# EAGLE design Temperature and Humidity tester (EAGLE 9.3.2)
Assembly variants: <unnamed>
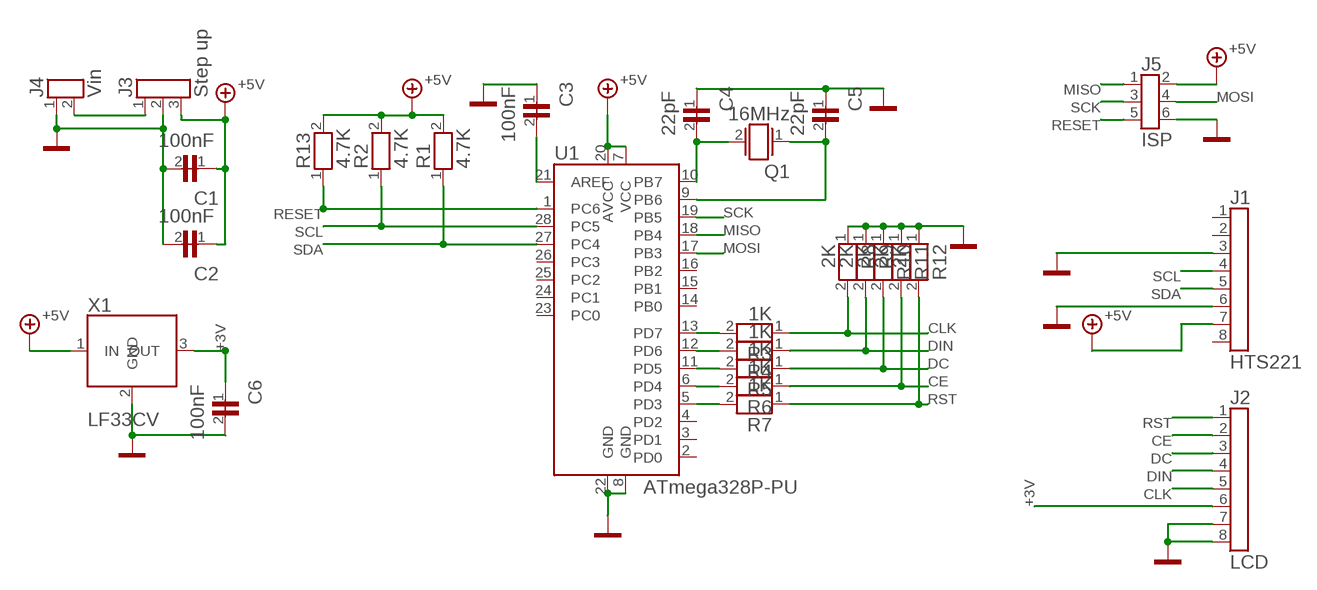
[diagram p0: schematic, sheet 1]

## Parts
C1  100nF  B37982-N5104-M_42  [3X5R2,54_42]
C2  100nF  B37982-N5104-M_43  [3X5R2,54_43]
C3  100nF  B37982-N5104-M_44  [3X5R2,54_44]
C4  22pF  C-CERAMIC-2,54_100V_2%_22PF_47  [6X6R2,54_DISC_47]
C5  22pF  C-CERAMIC-2,54_100V_2%_22PF_48  [6X6R2,54_DISC_48]
C6  100nF  B37982-N5104-M_66  [3X5R2,54_66]
J1  HTS221  PINHEADER_1X08_G_2,54_1  [STIFTLEISTE_1X08_G_2,54_1]
J2  LCD  PINHEADER_1X08_G_2,54_2  [STIFTLEISTE_1X08_G_2,54_2]
J3  Step up  PINHEADER_1X03_G_2,54_3  [STIFTLEISTE_1X03_G_2,54_3]
J4  Vin  PINHEADER_1X02_G_2,54_4  [STIFTLEISTE_1X02_G_2,54_4]
J5  ISP  PINHEADER_2X03_G_2,54_59  [STIFTLEISTE_2X03_G_2,54_59]
Q1  16MHz  LFXTAL003231_46  [HC49/U_46]
R1  4.7K  R_MET_10K_0204_27  [0204_MET_27]
R2  4.7K  R_MET_10K_0204_28  [0204_MET_28]
R3  1K  R_MET_10K_0204_31  [0204_MET_31]
R4  1K  R_MET_10K_0204_32  [0204_MET_32]
R5  1K  R_MET_10K_0204_33  [0204_MET_33]
R6  1K  R_MET_10K_0204_34  [0204_MET_34]
R7  1K  R_MET_10K_0204_35  [0204_MET_35]
R8  2K  R_MET_10K_0204_36  [0204_MET_36]
R9  2K  R_MET_10K_0204_37  [0204_MET_37]
R10  2K  R_MET_10K_0204_38  [0204_MET_38]
R11  2K  R_MET_10K_0204_39  [0204_MET_39]
R12  2K  R_MET_10K_0204_40  [0204_MET_40]
R13  4.7K  R_MET_10K_0204_57  [0204_MET_57]
U1  ATmega328P-PU  ATMEGA328P-PU_0  [DIL28_WB7,62_P2,54_0]
X1  LF33CV  LF33CV_62  [TO220_62]

## Nets
2: J3.1 J4.2
+3V: C6.1 J2.6 X1.3(OUT)
+5V: C1.1 C2.1 J1.7 J3.3 J5.2 R1.2 R2.2 R13.2 U1.7(VCC) U1.20(AVCC) X1.1(IN)
AREF: C3.2 U1.21(AREF)
CE: J2.2 R6.1 R11.2
CLK: J2.5 R3.1 R8.2
DC: J2.3 R5.1 R10.2
DIN: J2.4 R4.1 R9.2
GND: C1.2 C2.2 C3.1 C4.1 C5.1 C6.2 J1.3 J1.6 J2.7 J2.8 J3.2 J4.1 J5.6 R8.1 R9.1 R10.1 R11.1 R12.1 U1.8(GND) U1.22(GND) X1.2(GND)
MISO: J5.1 U1.18(PB4)
MOSI: J5.4 U1.17(PB3)
PB6: C5.2 Q1.1 U1.9(PB6)
PB7: C4.2 Q1.2 U1.10(PB7)
PD4: R6.2 U1.6(PD4)
PD6: R4.2 U1.12(PD6)
RESET: J5.5 R13.1 U1.1(PC6)
RST: J2.1 R7.1 R12.2
SCK: J5.3 U1.19(PB5)
SCL: J1.4 R2.1 U1.28(PC5)
SDA: J1.5 R1.1 U1.27(PC4)
SIG$33: R3.2 U1.13(PD7)
SIG$35: R5.2 U1.11(PD5)
SIG$37: R7.2 U1.5(PD3)
Unconnected: J1.1 J1.2 J1.8 U1.2(PD0) U1.3(PD1) U1.4(PD2) U1.14(PB0) U1.15(PB1) U1.16(PB2) U1.23(PC0) U1.24(PC1) U1.25(PC2) U1.26(PC3)

## Library data of the parts
C1 = TARGET3001!_V20.2.0.74:B37982-N5104-M_42
C2 = TARGET3001!_V20.2.0.74:B37982-N5104-M_43
C3 = TARGET3001!_V20.2.0.74:B37982-N5104-M_44
C4 = TARGET3001!_V20.2.0.74:C-CERAMIC-2,54_100V_2%_22PF_47: Typ EGPU ceramic generators for rectangles, 100 volt capacity. pF 22 ; material NPO ; tolerance ±2% ; dimension. mm 3,5 x
C5 = TARGET3001!_V20.2.0.74:C-CERAMIC-2,54_100V_2%_22PF_48: Typ EGPU ceramic generators for rectangles, 100 volt capacity. pF 22 ; material NPO ; tolerance ±2% ; dimension. mm 3,5 x
C6 = TARGET3001!_V20.2.0.74:B37982-N5104-M_66
J1 = TARGET3001!_V20.2.0.74:PINHEADER_1X08_G_2,54_1: Pin Header
J2 = TARGET3001!_V20.2.0.74:PINHEADER_1X08_G_2,54_2: Pin Header
J3 = TARGET3001!_V20.2.0.74:PINHEADER_1X03_G_2,54_3: Pin Header
J4 = TARGET3001!_V20.2.0.74:PINHEADER_1X02_G_2,54_4: Pin Header
J5 = TARGET3001!_V20.2.0.74:PINHEADER_2X03_G_2,54_59: Pin Header
Q1 = TARGET3001!_V20.2.0.74:LFXTAL003231_46: Quartz 16 MHz, LF XTAL003231, IQD, Series HC49, Frequency 16MHz,
R1 = TARGET3001!_V20.2.0.74:R_MET_10K_0204_27: Metal film resistor 10K-Ohm, 0,4W, 1%
R2 = TARGET3001!_V20.2.0.74:R_MET_10K_0204_28: Metal film resistor 10K-Ohm, 0,4W, 1%
R3 = TARGET3001!_V20.2.0.74:R_MET_10K_0204_31: Metal film resistor 10K-Ohm, 0,4W, 1%
R4 = TARGET3001!_V20.2.0.74:R_MET_10K_0204_32: Metal film resistor 10K-Ohm, 0,4W, 1%
R5 = TARGET3001!_V20.2.0.74:R_MET_10K_0204_33: Metal film resistor 10K-Ohm, 0,4W, 1%
R6 = TARGET3001!_V20.2.0.74:R_MET_10K_0204_34: Metal film resistor 10K-Ohm, 0,4W, 1%
R7 = TARGET3001!_V20.2.0.74:R_MET_10K_0204_35: Metal film resistor 10K-Ohm, 0,4W, 1%
R8 = TARGET3001!_V20.2.0.74:R_MET_10K_0204_36: Metal film resistor 10K-Ohm, 0,4W, 1%
R9 = TARGET3001!_V20.2.0.74:R_MET_10K_0204_37: Metal film resistor 10K-Ohm, 0,4W, 1%
R10 = TARGET3001!_V20.2.0.74:R_MET_10K_0204_38: Metal film resistor 10K-Ohm, 0,4W, 1%
R11 = TARGET3001!_V20.2.0.74:R_MET_10K_0204_39: Metal film resistor 10K-Ohm, 0,4W, 1%
R12 = TARGET3001!_V20.2.0.74:R_MET_10K_0204_40: Metal film resistor 10K-Ohm, 0,4W, 1%
R13 = TARGET3001!_V20.2.0.74:R_MET_10K_0204_57: Metal film resistor 10K-Ohm, 0,4W, 1%
U1 = TARGET3001!_V20.2.0.74:ATMEGA328P-PU_0: Atmel 8-bit Microcontroller with 32KBytes In-System Programmable Flash
X1 = TARGET3001!_V20.2.0.74:LF33CV_62: 3,3V Very Low Drop Voltage Regulators with Inhibit. 3-Lead TO220 Package.

## Board
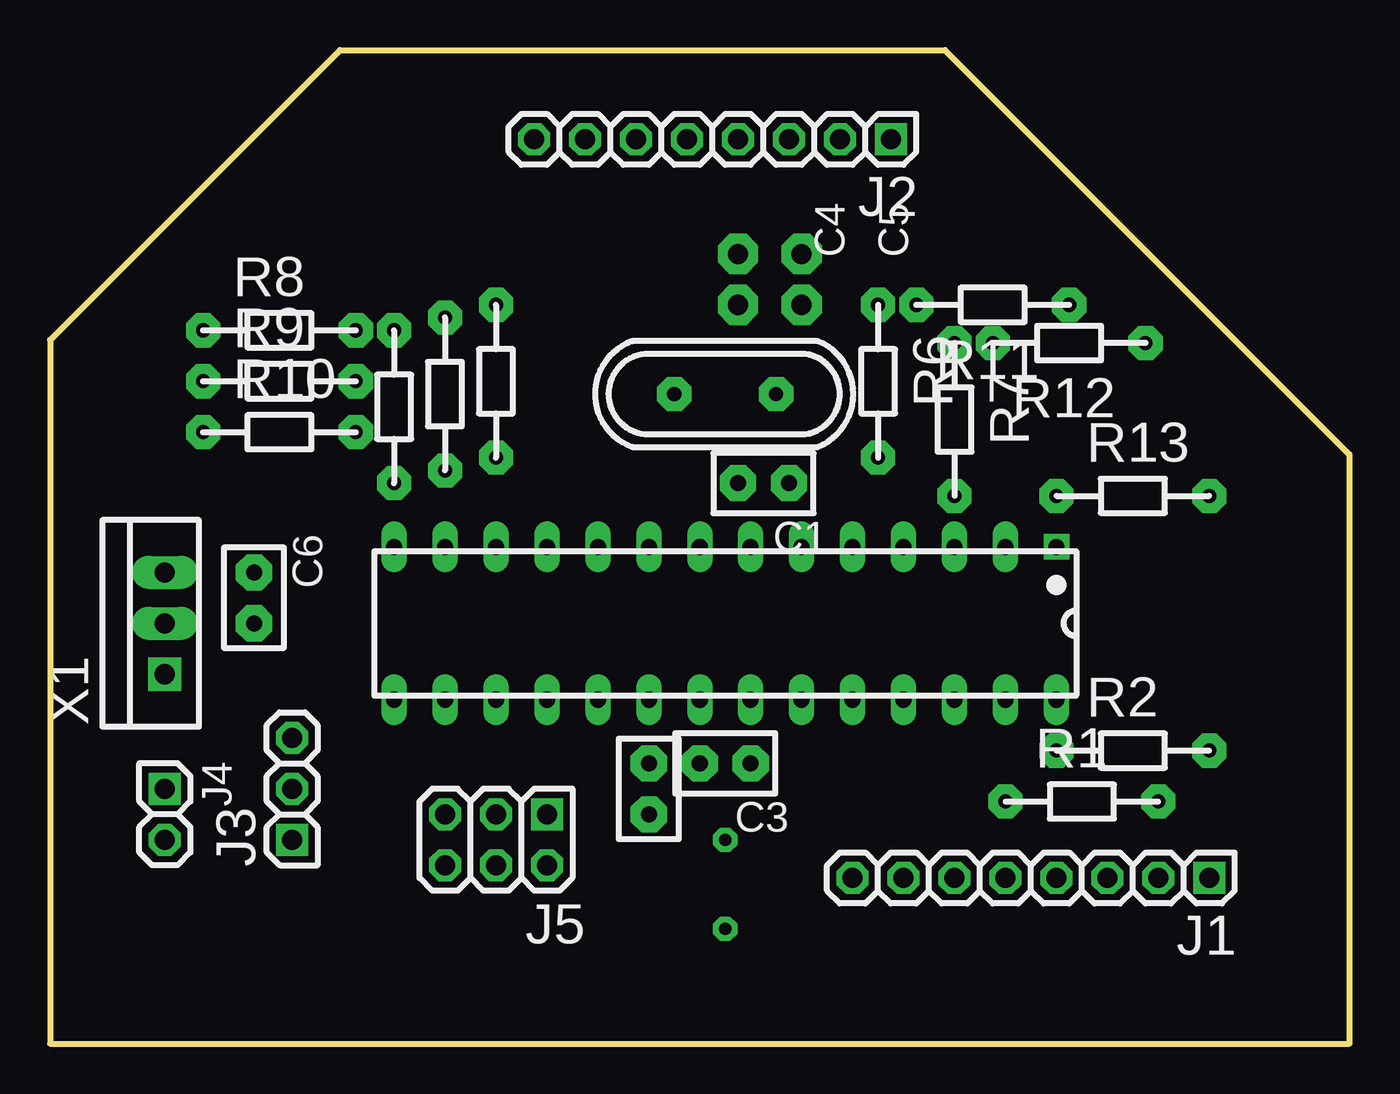
[diagram p1: board, top side]
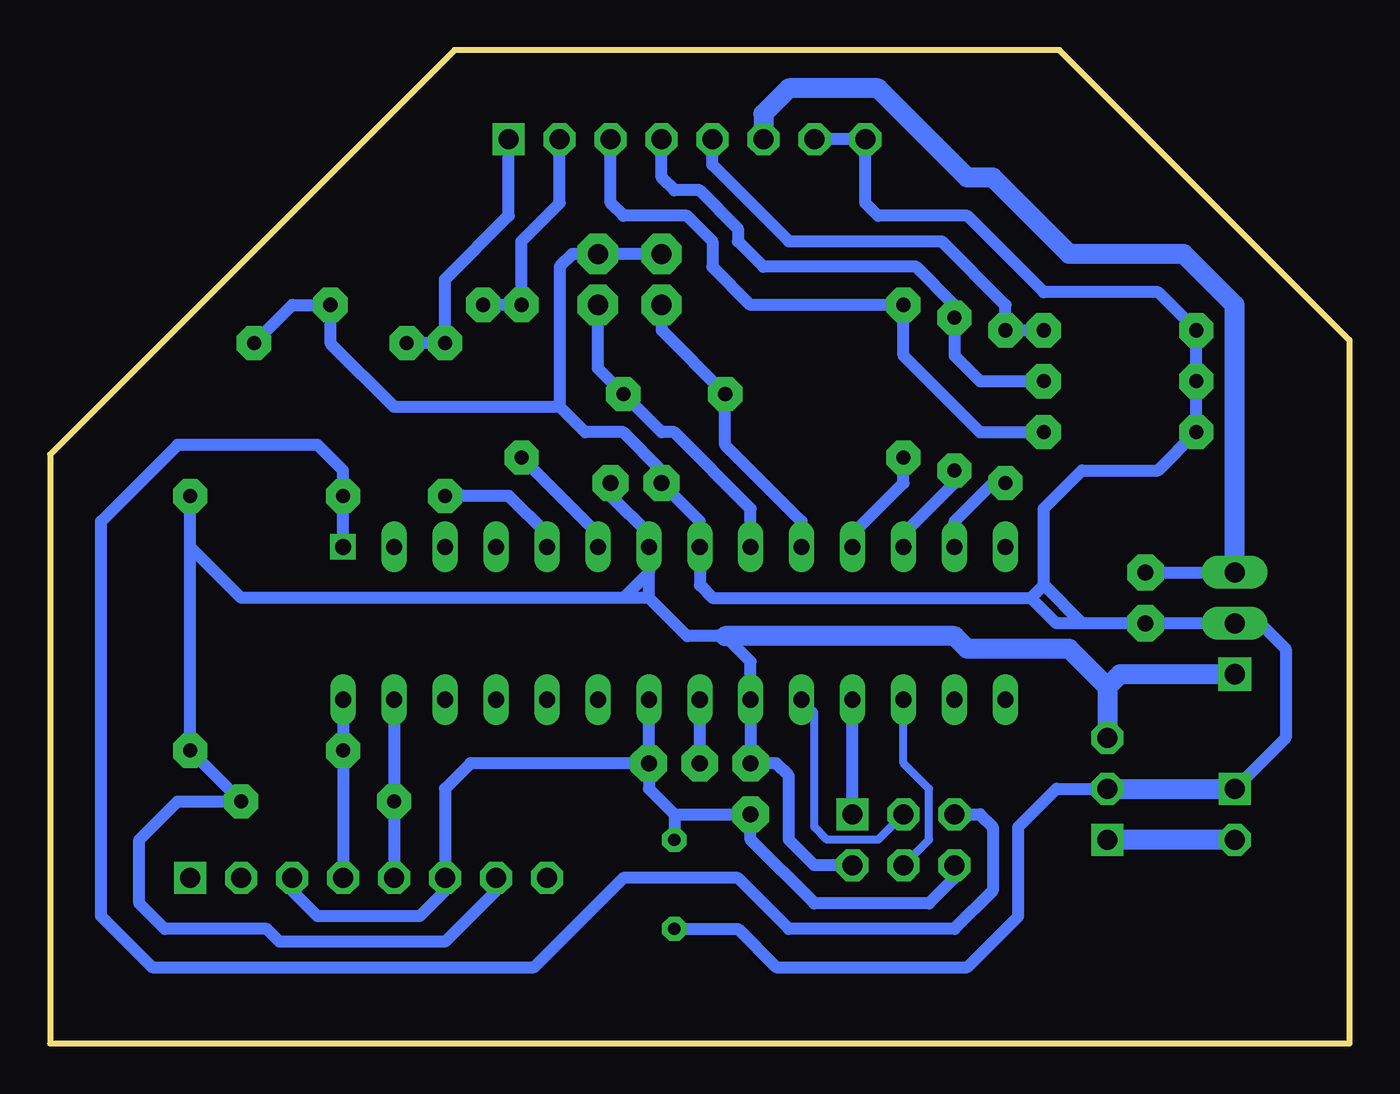
[diagram p2: board, bottom side, seen from below]

Size 64.77 x 49.53 mm. Coordinates in mm from the lower left corner, seen from the top.
Outline: 64.77,29.37 64.77,0 0,0 0,35.09 14.45,49.53 44.61,49.53 64.77,29.37
Copper layers (1*16): Top 0.035mm / dielectric 1.5mm / Bottom 0.035mm
Design rules "TARGET3001!": minimum track width 0.3mm, minimum drill 0.6mm, track to track 0.2mm, track to pad 0.2mm, pad to pad 0.2mm, via to via 0.2mm, smd to smd 0.2mm, copper to edge 1mm, drill to drill 0.3mm, minimum pad ring 0.235mm, minimum via ring 0.3mm, stop-mask expansion 4mil, vias tented up to drill 0mil, thermal gap 10mil

### Footprints (pad centres in the part's own frame; a part is rotated, then mirrored left to right if it is on the bottom)
3X5R2,54_42 = drill 0.8 pad 1.8 octagon: 1 -1.27,0; 2 1.27,0
3X5R2,54_43 = drill 0.8 pad 1.8 octagon: 1 -1.27,0; 2 1.27,0
3X5R2,54_44 = drill 0.8 pad 1.8 octagon: 1 -1.27,0; 2 1.27,0
6X6R2,54_DISC_47 = drill 1 pad 2 octagon: 1 -1.27,0; 2 1.27,0
6X6R2,54_DISC_48 = drill 1 pad 2 octagon: 1 -1.27,0; 2 1.27,0
3X5R2,54_66 = drill 0.8 pad 1.8 octagon: 1 -1.27,0; 2 1.27,0
STIFTLEISTE_1X08_G_2,54_1 = drill 1 pad 1.6 square: 1 0,0 | drill 1 pad 1.6 octagon: 2 2.54,0; 3 5.08,0; 4 7.62,0; 5 10.16,0; 6 12.7,0; 7 15.24,0; 8 17.78,0
STIFTLEISTE_1X08_G_2,54_2 = drill 1 pad 1.6 square: 1 0,0 | drill 1 pad 1.6 octagon: 2 2.54,0; 3 5.08,0; 4 7.62,0; 5 10.16,0; 6 12.7,0; 7 15.24,0; 8 17.78,0
STIFTLEISTE_1X03_G_2,54_3 = drill 1 pad 1.6 square: 1 0,0 | drill 1 pad 1.6 octagon: 2 2.54,0; 3 5.08,0
STIFTLEISTE_1X02_G_2,54_4 = drill 1 pad 1.6 square: 1 0,0 | drill 1 pad 1.6 octagon: 2 2.54,0
STIFTLEISTE_2X03_G_2,54_59 = drill 1 pad 1.6 square: 1 0,0 | drill 1 pad 1.6 octagon: 2 0,2.54; 3 2.54,0; 4 2.54,2.54; 5 5.08,0; 6 5.08,2.54
HC49/U_46 = drill 0.7 pad 1.7 octagon: 1 -2.54,0; 2 2.54,0
0204_MET_27 = drill 0.7 pad 1.7 octagon: 1 -3.81,0; 2 3.81,0
0204_MET_28 = drill 0.7 pad 1.7 octagon: 1 -3.81,0; 2 3.81,0
0204_MET_31 = drill 0.7 pad 1.7 octagon: 1 -3.81,0; 2 3.81,0
0204_MET_32 = drill 0.7 pad 1.7 octagon: 1 -3.81,0; 2 3.81,0
0204_MET_33 = drill 0.7 pad 1.7 octagon: 1 -3.81,0; 2 3.81,0
0204_MET_34 = drill 0.7 pad 1.7 octagon: 1 -3.81,0; 2 3.81,0
0204_MET_35 = drill 0.7 pad 1.7 octagon: 1 -3.81,0; 2 3.81,0
0204_MET_36 = drill 0.7 pad 1.7 octagon: 1 -3.81,0; 2 3.81,0
0204_MET_37 = drill 0.7 pad 1.7 octagon: 1 -3.81,0; 2 3.81,0
0204_MET_38 = drill 0.7 pad 1.7 octagon: 1 -3.81,0; 2 3.81,0
0204_MET_39 = drill 0.7 pad 1.7 octagon: 1 -3.81,0; 2 3.81,0
0204_MET_40 = drill 0.7 pad 1.7 octagon: 1 -3.81,0; 2 3.81,0
0204_MET_57 = drill 0.7 pad 1.7 octagon: 1 -3.81,0; 2 3.81,0
DIL28_WB7,62_P2,54_0 = drill 0.8 pad 1.27 square: 1 -16.51,-3.81 | drill 0.8 pad 1.27 long: 2 -13.97,-3.81; 3 -11.43,-3.81; 4 -8.89,-3.81; 5 -6.35,-3.81; 6 -3.81,-3.81; 7 -1.27,-3.81; 8 1.27,-3.81; 9 3.81,-3.81; 10 6.35,-3.81; 11 8.89,-3.81; 12 11.43,-3.81; 13 13.97,-3.81; 14 16.51,-3.81; 15 16.51,3.81; 16 13.97,3.81; 17 11.43,3.81; 18 8.89,3.81; 19 6.35,3.81; 20 3.81,3.81; 21 1.27,3.81; 22 -1.27,3.81; 23 -3.81,3.81; 24 -6.35,3.81; 25 -8.89,3.81; 26 -11.43,3.81; 27 -13.97,3.81; 28 -16.51,3.81
TO220_62 = drill 1 pad 1.651 square: 1 -2.54,0 | drill 1 pad 1.651 long: 2 0,0; 3 2.54,0

### Placement (x,y rotation side)
C1  35.56,27.94 180 top
C2  29.84,12.7 270 top
C3  33.66,13.97 180 top
C4  34.29,38.1 270 top
C5  37.46,38.1 270 top
C6  10.16,22.23 270 top
J1  57.78,8.26 180 top
J2  41.91,45.09 180 top
J3  12.07,10.16 90 top
J4  5.71,12.7 270 top
J5  24.77,11.43 180 top
Q1  33.66,32.38 180 top
R1  51.44,12.06 0 top
R2  53.98,14.61 0 top
R3  17.14,31.75 270 top
R4  19.68,32.38 270 top
R5  22.22,33.02 270 top
R6  41.27,33.02 270 top
R7  45.09,31.11 270 top
R8  11.43,35.56 0 top
R9  11.43,33.02 0 top
R10  11.43,30.48 0 top
R11  46.99,36.83 180 top
R12  50.8,34.92 180 top
R13  53.98,27.3 0 top
U1  33.66,20.95 180 top
X1  5.71,20.95 90 top

### Tracks (layer width: path | path; a pad name or v marks a point on that pad's centre or on a via)
2
  Bottom 1: J4.2 J3.1
+3V
  Bottom 0.6: C6.1 X1.3
  Bottom 1: X1.3 5.71,36.83 8.26,39.37 13.97,39.37 17.78,43.18 19.05,43.18 23.49,47.62 27.94,47.62 29.21,46.35 J2.6
+5V
  Bottom 0.6: C1.1 36.83,27.3 34.92,25.4 U1.7 34.92,23.5 | 57.78,24.77 R2.2 R1.2 58.42,12.06 60.32,10.16 60.32,6.99 59.05,5.71 53.98,5.71 53.34,5.08 45.09,5.08 42.55,7.62 J1.7 | 34.92,23.5 36.2,22.23 | 36.2,22.23 55.24,22.23 57.78,24.77 | 57.78,24.77 R13.2 | 34.92,22.23 33.02,20.32 31.12,20.32 29.84,19.05 U1.20 C2.1 28.57,13.97 27.94,13.34 27.94,10.16 26.67,8.89 J5.2 | 34.92,22.23 34.92,23.5 | 34.92,22.23 36.2,22.23
  Bottom 1: X1.1 11.43,18.41 12.07,17.78 | 12.07,17.78 J3.3 | 12.07,17.78 13.97,19.68 19.05,19.68 19.68,20.32 31.12,20.32
AREF
  Bottom 0.6: C3.2 U1.21
CE
  Bottom 0.6: R11.2 R6.1 41.27,40.01 39.37,41.91 J2.2
CLK
  Bottom 0.6: R8.2 R3.1 17.14,36.83 20.32,40.01 27.94,40.01 31.75,43.81 J2.5
DC
  Bottom 0.6: R10.2 18.41,30.48 22.22,34.29 R5.1 29.84,36.83 31.75,38.73 31.75,40.01 33.02,41.27 36.2,41.27 36.83,41.91 J2.3
DIN
  Bottom 0.6: R9.2 18.41,33.02 19.68,34.29 R4.1 19.68,36.83 21.59,38.73 29.21,38.73 30.48,40.01 30.48,40.64 32.38,42.55 33.66,42.55 34.29,43.18 J2.4
GND  (via drill 0.6 pad 1.2)
  Bottom 0.3: C6.2 13.34,20.95
  Bottom 0.6: J2.7 J2.8 24.13,41.91 23.49,41.27 19.05,41.27 15.24,37.47 9.53,37.47 R8.1 R9.1 R10.1 9.53,28.57 13.34,28.57 15.24,26.67 15.24,22.86 | C4.1 C5.1 38.73,39.37 39.37,38.73 39.37,31.75 | 39.37,31.75 38.1,30.48 36.2,30.48 34.29,28.57 C1.2 32.38,26.04 U1.8 32.38,22.86 31.75,22.23 15.88,22.23 | C3.1 U1.22 | C3.1 34.92,12.7 33.66,11.43 | 33.66,11.43 C2.2 29.84,10.16 26.67,6.99 20.95,6.99 19.68,8.26 J5.6 | C3.1 43.81,13.97 45.09,12.7 J1.6 45.09,7.62 46.35,6.35 51.44,6.35 52.7,7.62 J1.3 | R12.1 52.7,36.83 R11.1 50.8,34.92 47.62,31.75 39.37,31.75 | 15.88,22.23 15.24,22.86 | 15.88,22.23 14.61,20.95 13.34,20.95 | 15.24,22.86 13.34,20.95 | J4.1 3.17,15.24 3.17,19.68 4.44,20.95 X1.2 C6.2 13.34,20.95 | 33.66,11.43 v33.66,10.16 | v33.66,5.71 30.48,5.71 28.57,3.81 19.05,3.81 16.51,6.35 16.51,10.79 14.61,12.7 J3.2
  Bottom 1: J3.2 J4.1
MISO
  Bottom 0.6: J5.1 U1.18
MOSI
  Bottom 0.4: J5.4 20.95,10.16 20.95,12.7 22.22,13.97 U1.17
PB6
  Bottom 0.6: U1.9 29.84,26.67 33.66,30.48 34.29,30.48 Q1.1 37.46,33.66 C5.2
PB7
  Bottom 0.6: U1.10 27.3,26.04 31.12,29.84 Q1.2 34.29,35.56 C4.2
PD4
  Bottom 0.3: R6.2
  Bottom 0.6: U1.6 37.46,25.4 R6.2
PD6
  Bottom 0.6: U1.12 22.22,25.4 19.68,27.94 R4.2
RESET
  Bottom 0.6: U1.1 R13.1 50.16,28.57 51.44,29.84 58.42,29.84 62.23,26.04 62.23,6.35 59.69,3.81 40.64,3.81 36.2,8.26 30.48,8.26 27.94,5.71 19.68,5.71 17.78,7.62 17.78,10.79 18.41,11.43 J5.5
RST
  Bottom 0.6: R12.2 R7.1 45.09,38.1 41.91,41.27 J2.1
SCK
  Bottom 0.4: J5.3 23.49,10.16 26.04,10.16 26.67,10.79 26.67,16.51 U1.19
SCL
  Bottom 0.6: U1.28 R2.1 J1.4
SDA
  Bottom 0.6: U1.27 R1.1 J1.5
SIG$33
  Bottom 0.6: U1.13 19.68,26.04 17.78,27.94 R3.2
SIG$35
  Bottom 0.6: U1.11 24.77,25.4 22.22,27.94 R5.2
SIG$37
  Bottom 0.6: U1.5 40,25.4 41.91,27.3 R7.2